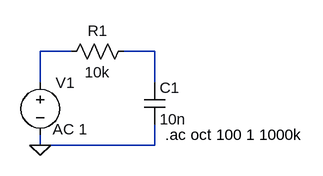
[diagram p0: schematic 1stOrderLPF.asc]
1stOrderLPF.asc, the LTspice schematic file:
Version 4
SHEET 1 880 680
WIRE 80 64 32 64
WIRE 208 64 160 64
WIRE 32 112 32 64
WIRE 208 112 208 64
WIRE 32 208 32 192
WIRE 208 208 208 176
WIRE 208 208 32 208
FLAG 32 208 0
SYMBOL cap 192 112 R0
SYMATTR InstName C1
SYMATTR Value 10n
SYMBOL res 176 48 R90
WINDOW 0 0 56 VBottom 2
WINDOW 3 32 56 VTop 2
SYMATTR InstName R1
SYMATTR Value 10k
SYMBOL voltage 32 96 R0
WINDOW 123 19 88 Left 2
WINDOW 39 0 0 Left 0
SYMATTR Value2 AC 1
SYMATTR InstName V1
SYMATTR Value ""
TEXT 224 192 Left 2 !.ac oct 100 1 1000k

The netlist it stands for:
* 1stOrderLPF.asc
C1 N002 0 10n
R1 N002 N001 10k
V1 N001 0 AC 1
.ac oct 100 1 1000k
.backanno
.end